# Altium project PE1V2_PCB.PrjPcb
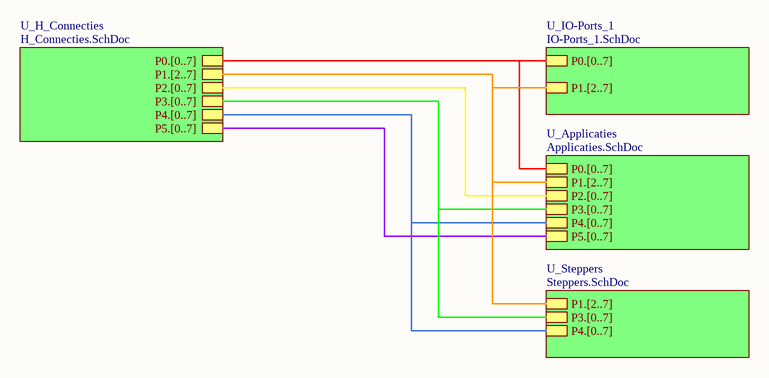
[diagram p0: Top.SchDoc]
5 sheets, 97 parts. Net scope: global (net labels, ports and power ports of the same name join across sheets).
Board file: Pe1V2_PCB.PcbDoc
Sheets:
  Top.SchDoc
    U_H_Connecties = H_Connecties.SchDoc
    U_IO-Ports_1 = IO-Ports_1.SchDoc
    U_Applicaties = Applicaties.SchDoc
    U_Steppers = Steppers.SchDoc

## Sheet Top.SchDoc
size A4; SheetNumber: 1; SheetTotal: 5

### Sub-sheets
U_Applicaties = Applicaties.SchDoc: P5.[0..7], P2.[0..7], P4.[0..7], P3.[0..7], P1.[2..7], P0.[0..7]
U_H_Connecties = H_Connecties.SchDoc: P0.[0..7], P2.[0..7], P4.[0..7], P3.[0..7], P5.[0..7], P1.[2..7]
U_IO-Ports_1 = IO-Ports_1.SchDoc: P0.[0..7], P1.[2..7]
U_Steppers = Steppers.SchDoc: P1.[2..7], P4.[0..7], P3.[0..7]

### Buses and harness runs
bus sheet U_Applicaties/P0.[0..7] = sheet U_H_Connecties/P0.[0..7] = sheet U_IO-Ports_1/P0.[0..7]
bus sheet U_Applicaties/P1.[2..7] = sheet U_H_Connecties/P1.[2..7] = sheet U_IO-Ports_1/P1.[2..7] = sheet U_Steppers/P1.[2..7]
bus sheet U_Applicaties/P2.[0..7] = sheet U_H_Connecties/P2.[0..7]
bus sheet U_Applicaties/P3.[0..7] = sheet U_H_Connecties/P3.[0..7] = sheet U_Steppers/P3.[0..7]
bus sheet U_Applicaties/P4.[0..7] = sheet U_H_Connecties/P4.[0..7] = sheet U_Steppers/P4.[0..7]
bus sheet U_Applicaties/P5.[0..7] = sheet U_H_Connecties/P5.[0..7]

## Sheet H_Connecties.SchDoc
size A4; SheetNumber: 2; SheetTotal: 5
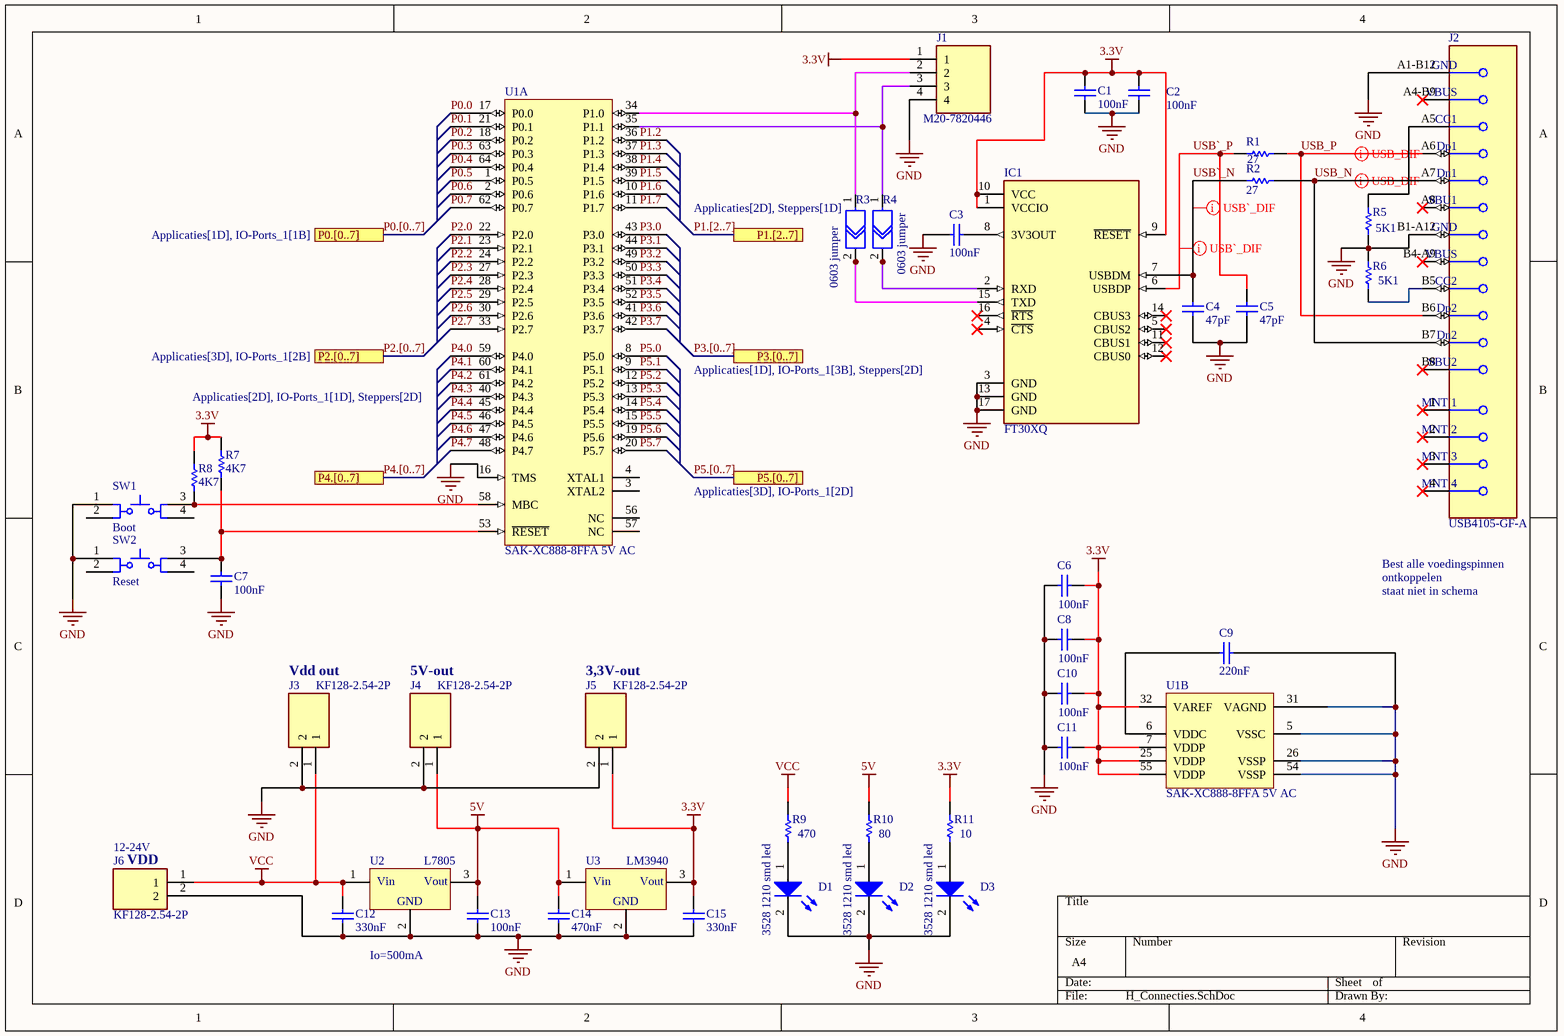
[diagram p1: H_Connecties.SchDoc]

### Parts
C1  100nF  [CAPC1608X90X35LL15T15]
C2  100nF  [CAPC1608X90X35LL15T15]
C3  100nF  [CAPC1608X90X35LL15T15]
C4  47pF  [CAPC1608X90X35LL15T15]
C5  47pF  [CAPC1608X90X35LL15T15]
C6  100nF  [CAPC1608X92X38NL15T08]
C7  100nF  [CAPC1608X90X35LL15T15]
C8  100nF  [CAPC1608X92X38NL15T08]
C9  220nF  [CAPC1608X95X40LL15T15]
C10  100nF  [CAPC1608X92X38NL15T08]
C11  100nF  [CAPC1608X92X38NL15T08]
C12  330nF  [CAPC1608X90X35LL15T15]
C13  100nF  [CAPC1608X90X35LL15T15]
C14  470nF  [CAPC1608X90X35LL15T15]
C15  330nF  [CAPC1608X90X35LL15T15]
D1  3528 1210 smd led  [WL-SITW_3528_L3.5W2.8H1.9]
D2  3528 1210 smd led  [WL-SITW_3528_L3.5W2.8H1.9]
D3  3528 1210 smd led  [WL-SITW_3528_L3.5W2.8H1.9]
IC1  FT30XQ  [FT30XQ]
J1  M20-7820446  [M20-4pin]
J2  USB4105-GF-A  [FP-USB4105-GF-A-MFG]
J3  KF128-2.54-2P  [KF128-2.54-2P]
J4  KF128-2.54-2P  [KF128-2.54-2P]
J5  KF128-2.54-2P  [KF128-2.54-2P]
J6  KF128-2.54-2P  [KF128-2.54-2P]
R1  27  [RESC1608X55X25LL10T15]
R2  27  [RESC1608X55X25LL10T15]
R3  0603 jumper  [0603 jumper]
R4  0603 jumper  [0603 jumper]
R5  5K1  [RESC1608X55X25LL10T15]
R6  5K1  [RESC1608X55X25LL10T15]
R7  4K7  [RESC1608X55X25LL10T15]
R8  4K7  [RESC1608X55X25LL10T15]
R9  470  [RESC1608X55X25LL10T15]
R10  80  [RESC1608X55X25LL10T15]
R11  10  [RESC1608X55X25LL10T15]
SW1  Boot  [ESWI-TL1105SPF_V]
SW2  Reset  [ESWI-TL1105SPF_V]
U1  SAK-XC888-8FFA 5V AC  [INF-PG-TQFP-64-8_L]  (parts A,B of 2)
U2  L7805  [DPAK]
U3  LM3940  [SOT-233]

### Ports
P0.[0..7] (see Applicaties[1D], IO-Ports_1[1B]), P1.[2..7] (see Applicaties[2D], Steppers[1D]), P2.[0..7] (see Applicaties[3D], IO-Ports_1[2B]), P3.[0..7] (see Applicaties[1D], IO-Ports_1[3B], Steppers[2D]), P4.[0..7] (see Applicaties[2D], IO-Ports_1[1D], Steppers[2D]), P5.[0..7] (see Applicaties[3D], IO-Ports_1[2D])

### Nets
3.3V: C1.2 C2.2 C6.2 C8.2 C10.2 C11.2 C15.2 IC1.1(VCCIO) IC1.9(~{RESET}) IC1.10(VCC) J1.1 J5.1 R7.2 R8.2 R11.1 U1.7(VDDP) U1.25(VDDP) U1.32(VAREF) U1.55(VDDP) U3.3
5V: C13.2 C14.2 J4.1 R10.1 U2.3 U3.1
GND: C1.1 C2.1 C3.2 C4.1 C5.1 C6.1 C7.1 C8.1 C9.2 C10.1 C11.1 C12.1 C13.1 C14.1 C15.1 D1.2(K) D2.2(K) D3.2(K) IC1.3(GND) IC1.13(GND) IC1.17(GND) J1.4 J2.A1-B12(GND) J2.B1-A12(GND) J3.2 J4.2 J5.2 J6.2 R5.2 R6.1 SW1.1 SW2.1 U1.5(VSSC) U1.16(TMS) U1.26(VSSP) U1.31(VAGND) U1.54(VSSP) U2.2 U3.2
VCC: C12.2 J3.1 J6.1 R9.1 U2.1
P0.0: U1.17(P0.0)  [project net Led_1]
P0.1: U1.21(P0.1)  [project net Led_2]
P0.2: U1.18(P0.2)  [project net Led_3]
P0.3: U1.63(P0.3)
P0.4: U1.64(P0.4)
P0.5: U1.1(P0.5)
P0.6: U1.2(P0.6)  [project net Led_4]
P0.7: U1.62(P0.7)
P1.2: U1.36(P1.2)  [project net Dir_1_P1.2]
P1.3: U1.37(P1.3)
P1.4: U1.38(P1.4)  [project net Dir_2_P1.4]
P1.5: U1.39(P1.5)
P1.6: U1.10(P1.6)  [project net Led_5]
P1.7: U1.11(P1.7)  [project net Led_6]
P2.0: U1.22(P2.0)
P2.1: U1.23(P2.1)
P2.2: U1.24(P2.2)
P2.3: U1.27(P2.3)
P2.4: U1.28(P2.4)
P2.5: U1.29(P2.5)
P2.6: U1.30(P2.6)
P2.7: U1.33(P2.7)
P3.0: U1.43(P3.0)  [project net P3.0]
P3.1: U1.44(P3.1)  [project net P3.1]
P3.2: U1.49(P3.2)  [project net P3.2]
P3.3: U1.50(P3.3)  [project net P3.3]
P3.4: U1.51(P3.4)  [project net P3.4]
P3.5: U1.52(P3.5)  [project net P3.5]
P3.6: U1.41(P3.6)  [project net P3.6]
P3.7: U1.42(P3.7)  [project net P3.7]
P4.0: U1.59(P4.0)  [project net Enable]
P4.1: U1.60(P4.1)
P4.2: U1.61(P4.2)
P4.3: U1.40(P4.3)
P4.4: U1.45(P4.4)  [project net Dir_5_P4.4]
P4.5: U1.46(P4.5)
P4.6: U1.47(P4.6)  [project net Dir_6_P4.6]
P4.7: U1.48(P4.7)
P5.0: U1.8(P5.0)
P5.1: U1.9(P5.1)
P5.2: U1.12(P5.2)  [project net CS]
P5.3: U1.13(P5.3)  [project net A0]
P5.4: U1.14(P5.4)
P5.5: U1.15(P5.5)
P5.6: U1.19(P5.6)
P5.7: U1.20(P5.7)
USB_N: J2.A7(Dn1) J2.B7(Dn2) R2.1
USB_P: J2.A6(Dp1) J2.B6(Dp2) R1.1
USB`_N: C4.2 IC1.7(USBDM) R2.2
USB`_P: C5.2 IC1.6(USBDP) R1.2
NetC3_1: C3.1 IC1.8(3V3OUT)
NetC7_2: C7.2 R7.1 SW2.3 U1.53(~{RESET})
NetC9_1: C9.1 U1.6(VDDC)
NetD1_1: D1.1(A) R9.2
NetD2_1: D2.1(A) R10.2
NetD3_1: D3.1(A) R11.2
NetIC1_2: IC1.2(RXD) R4.2
NetIC1_15: IC1.15(TXD) R3.2
NetJ1_2: J1.2 R3.1 U1.34(P1.0)
NetJ1_3: J1.3 R4.1 U1.35(P1.1)
NetJ2_A5: J2.A5(CC1) R5.1
NetJ2_B5: J2.B5(CC2) R6.2
NetR8_1: R8.1 SW1.3 U1.58(MBC)

Not connected (* = marked no-connect by the designer): IC1 4(~{CTS})* 5(CBUS2)* 11(CBUS1)* 12(CBUS0)* 14(CBUS3)* 16(~{RTS})*; J2 1(MNT_1)* 2(MNT_2)* 3(MNT_3)* 4(MNT_4)* A4-B9(VBUS)* A8(SBU1)* B4-A9(VBUS)* B8(SBU2)*; SW1 2 4; SW2 2 4; U1 3(XTAL2) 4(XTAL1) 56(NC) 57(NC)

### Buses and harness runs
bus P0.[0..7] = port P0.[0..7]
bus P1.[2..7] = port P1.[2..7]
bus P2.[0..7] = port P2.[0..7]
bus P3.[0..7] = port P3.[0..7]
bus P4.[0..7] = port P4.[0..7]
bus P5.[0..7] = port P5.[0..7]

### Layout directives
differential pair: USB_N, USB_P, USB`_N, USB`_P

### Notes on the sheet
- Best alle voedingspinnen
- ontkoppelen
- staat niet in schema
- Vdd out
- 5V-out
- 3,3V-out
- (near J6) 12-24V
- (near J6) VDD
- Io=500mA
- (in symbol L7805) Vin; Vout; GND
- (in symbol LM3940) Vin; Vout; GND

### Library data of the parts
C1-C5 C7 C12-C15 = CMP-2006-02133-1: Manufacturer: AVX Interconnect / Elco; Part Number: 0603ZC101KAT2A
C6 C8 C10 C11 = CMP-2006-01211-1: Manufacturer: Vitramon; Part Number: VJ0603Y104KXJAP
C9 = CMP-2006-00068-1: Part Number: VJ0603Y224KXXCW1BC; Manufacturer: Vitramon
D1-D3 = CMP-03913-90235592-1: 15414185BA210 WL-SITW SMT InfraRed TopLED Waterclear; Forward Current: 700mA; Wavelength: 850nm; Max Reverse Voltage (DC): 5V; Forward Voltage: 1.5V; Viewing Angle: 120°; Length: 3.2mm; NexarPartId: 90235592; Width: 2.8mm; RoHS: Compliant; Packaging: Tape and Reel; Max Operating Temperature: 85°C; Peak Wavelength: 850nm; Min Operating Temperature: -40°C; Height: 1.9mm
J1 = M20-7820446: Connector; Manufacturer_Name: Harwin; Datasheet Link: https://cdn.harwin.com/pdfs/M20-782.pdf; Height: 8.65mm; Manufacturer_Part_Number: M20-7820446; Mouser Part Number: 855-M20-7820446; Mouser Price/Stock: https://www.mouser.co.uk/ProductDetail/Harwin/M20-7820446?qs=vF78I%252BjhbY8%252Bno0H8mp9XA%3D%3D
J2 = CMP-245163-000001-1: CONN RCPT USB2.0 TYPEC 5A; Manufacturer: GCT; Voltage Rating: 20V; Is Female: yes; Current Rating: 5/6.25/1.25/0.25A; Number Of Contacts: 16; Conn Orientation: Right Angle; Device Class L1: Connectors; Category: Conn; Lead Free: Yes; RoHS: TRUE; Temperature Range High: +85°C; Digikey Description: CONN RCPT USB2.0 TYPEC 5A; Device Class L3: unset; ComponentLink2Description: Datasheet; Manufacturer Part Number: USB4105-GF-A; Package: 0; Usb Standard: USB 2.0; Device Class L2: USB Connectors; Automotive: No; Temperature Range Low: -40°C; Height: 3.46mm; Temperature: -40°C to +85°C; Contact Material: Gold,Nickel; ComponentLink2URL: https://gct.co/files/drawings/usb4105.pdf; Octopart: https://octopart.com/usb4105-gf-a-gct-106627878
J3-J6 = KF128-2.54-2P: Connector; Manufacturer_Name: CIXI KEFA ELECTRONICS; Datasheet Link: https://jirorwxhqiillo5p.ldycdn.com/KF128-2.54-aidqpBpqKirRliSqmrqirlki.pdf; Height: 9.1mm; Manufacturer_Part_Number: KF128-2.54-2P
R1 R2 R5-R11 = CMP-2000-04183-1: Part Number: RC0603FR-102KL; Manufacturer: Yageo
SW1 SW2 = CMP-2000-07248-1: Tact Switch, SPST-NO, 50 mA, 12 VDC, -20 to 70 degC, 4-Pin THD, RoHS, Bulk; Manufacturer: E-Switch; Actuation Force: 1.6N; Actuator Style: RoundButton; Package URL: http://spec_sheets.e-switch.com/specs/P010201.pdf; Contact Material: Silver; Size: 6x6mm; Manufacturer URL: http://www.e-switch.ch/en/; Datasheet Version: 12/2013; Package Description: 4-Pin Through Hole Device, Body 6 x 6 mm; Datasheet URL: https://www.e-switch.com/system/asset/product_line/data_sheet/140/TL1105.pdf; Termination Style: RightAngle; Package Reference: TL1105SPF; Mounting Technology: ThroughHole
U1 = CMP-1147-00075-1: 24 MHz XC800-Automotive MCU with 32 KByte Program Memory, 1.75 KByte SRAM, 5 V, PG-LQFP-64, Reel, Green; Manufacturer: Infineon; A / D input lines (incl. FADC): 8; Digital I/O Lines: 48; Oscillator Watchdog: TRUE; Serial I/O Interfaces: 3; Real Time Clock (RTC): FALSE; I/O Operation Voltages: 5Â V; Program Memory: 32Â KByte; SRAM (incl. Cache): 1.75Â KByte; Max Clock Frequency: 24Â MHz; Type of Memory: Flash; Timer / Counter: 4; CAN Nodes: 0; Type of Serial I/O Interfaces: UART(2), SSC(1); Number of ADC Modules: 1; LIN BSL loader (for fast Flash programming): FALSE; ComponentLink2Description: Datasheet; ComponentLink2URL: http://www.infineon.com/dgdl/XC88xCLM_ds_V1_2.pdf?folderId=db3a304412b407950112b408e8c90004&fileId=db3a304412b407950112b40c4a9e0afb; ComponentLink3URL: http://www.infineon.com/dgdl/xc164lm_ds_v1.2_2007_03.pdf?folderId=db3a304412b407950112b408e8c90004&fileId=db3a304412b407950112b40c22200a81&sId=db3a30433d956bc3013d9e7060dd2801; PartNumber: SAK-XC888-8FFA 5V AC; PackageReference: PG-TQFP-64-8; PackageDescription: 64-Pin Plastic Thin Quad Flat Package, Body 10 x 10 mm, Pitch 0.5 mm; DSP functionality (e.g MDU/MAC): FALSE; On-chip Voltage Regulator: TRUE; On-chip clock generation: TRUE; Mounting Technology: Surface Mount; Green: TRUE; Watchdog Timer: TRUE; Instruction width [bits]: 8; DatasheetVersion: Rev. 1.2; Halogen-free: TRUE; ComponentLink1Description: Manufacturer URL; PackageVersion: V1.2, 03/2007; ComponentLink1URL: http://www.infineon.com/; Timed I/O Pins (PWM-Ch,CAPCOM): 4; Power Modes: 4; DMA Channels: 0; ComponentLink3Description: Package Specification; E2PROM Emulation (Data-Flash): TRUE
U2 = L7805: Linaire spannings omvormer
U3 = LM3940: 5V --> 3.3V

## Sheet IO-Ports_1.SchDoc
size A4; SheetNumber: 5; SheetTotal: 5
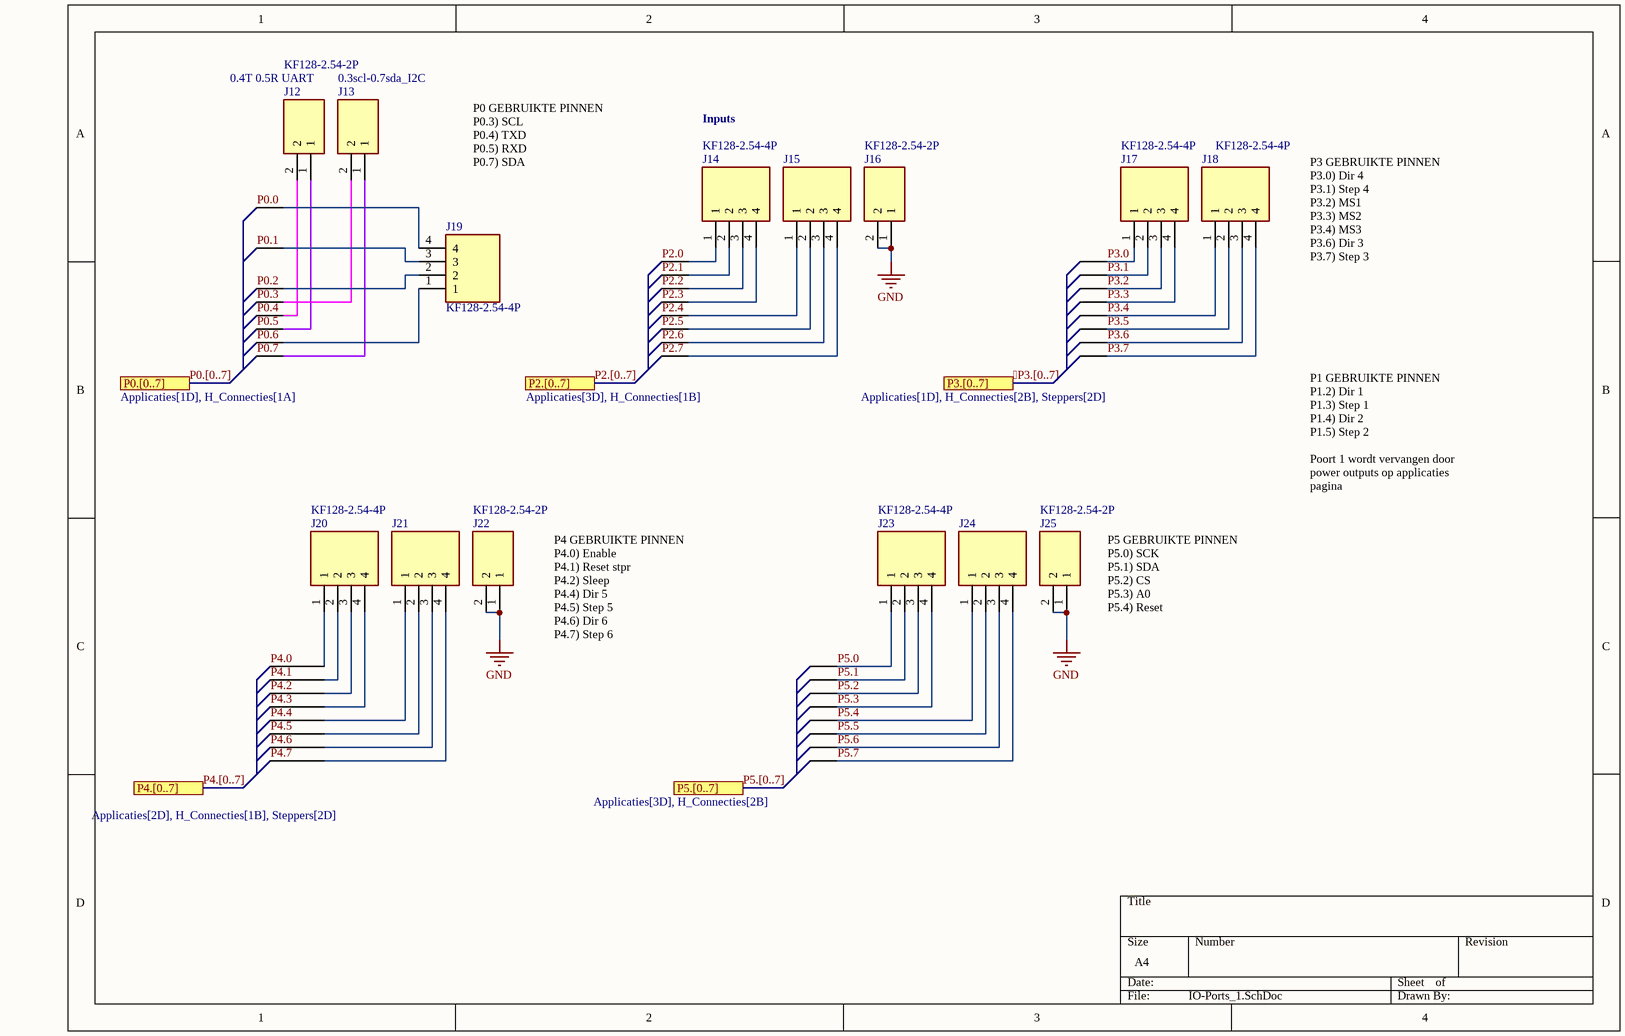
[diagram p2: IO-Ports_1.SchDoc]

### Parts
J12  KF128-2.54-2P  [KF128-2.54-2P]
J13  (no value)  [KF128-2.54-2P]
J14  KF128-2.54-4P  [KF128-2.54-4P]
J15  (no value)  [KF128-2.54-4P]
J16  KF128-2.54-2P  [KF128-2.54-2P]
J17  KF128-2.54-4P  [KF128-2.54-4P]
J18  KF128-2.54-4P  [KF128-2.54-4P]
J19  KF128-2.54-4P  [KF128-2.54-4P]
J20  KF128-2.54-4P  [KF128-2.54-4P]
J21  (no value)  [KF128-2.54-4P]
J22  KF128-2.54-2P  [KF128-2.54-2P]
J23  KF128-2.54-4P  [KF128-2.54-4P]
J24  (no value)  [KF128-2.54-4P]
J25  KF128-2.54-2P  [KF128-2.54-2P]

### Ports
P0.[0..7] (see Applicaties[1D], H_Connecties[1A]), P2.[0..7] (see Applicaties[3D], H_Connecties[1B]), P3.[0..7] (see Applicaties[1D], H_Connecties[2B], Steppers[2D]), P4.[0..7] (see Applicaties[2D], H_Connecties[1B], Steppers[2D]), P5.[0..7] (see Applicaties[3D], H_Connecties[2B])

### Nets
GND: J16.1 J16.2 J22.1 J22.2 J25.1 J25.2
P0.0: J19.4  [project net Led_1]
P0.1: J19.3  [project net Led_2]
P0.2: J19.2  [project net Led_3]
P0.3: J13.2
P0.4: J12.2
P0.5: J12.1
P0.6: J19.1  [project net Led_4]
P0.7: J13.1
P2.0: J14.1
P2.1: J14.2
P2.2: J14.3
P2.3: J14.4
P2.4: J15.1
P2.5: J15.2
P2.6: J15.3
P2.7: J15.4
P3.0: J17.1  [project net P3.0]
P3.1: J17.2  [project net P3.1]
P3.2: J17.3  [project net P3.2]
P3.3: J17.4  [project net P3.3]
P3.4: J18.1  [project net P3.4]
P3.5: J18.2  [project net P3.5]
P3.6: J18.3  [project net P3.6]
P3.7: J18.4  [project net P3.7]
P4.0: J20.1  [project net Enable]
P4.1: J20.2
P4.2: J20.3
P4.3: J20.4
P4.4: J21.1  [project net Dir_5_P4.4]
P4.5: J21.2
P4.6: J21.3  [project net Dir_6_P4.6]
P4.7: J21.4
P5.0: J23.1
P5.1: J23.2
P5.2: J23.3  [project net CS]
P5.3: J23.4  [project net A0]
P5.4: J24.1
P5.5: J24.2
P5.6: J24.3
P5.7: J24.4

### Buses and harness runs
bus P3.[0..7] =  = port P3.[0..7]
bus P0.[0..7] = port P0.[0..7]
bus P2.[0..7] = port P2.[0..7]
bus P4.[0..7] = port P4.[0..7]
bus P5.[0..7] =  = port P5.[0..7]

### Notes on the sheet
- 0.4T 0.5R UART
- 0.3scl-0.7sda_I2C
- P0 GEBRUIKTE PINNEN
  P0.3) SCL
  P0.4) TXD
  P0.5) RXD
  P0.7) SDA
- Inputs
- P3 GEBRUIKTE PINNEN
  P3.0) Dir 4
  P3.1) Step 4
  P3.2) MS1
  P3.3) MS2
  P3.4) MS3
  P3.6) Dir 3
  P3.7) Step 3
- P1 GEBRUIKTE PINNEN
  P1.2) Dir 1
  P1.3) Step 1
  P1.4) Dir 2
  P1.5) Step 2
  Poort 1 wordt vervangen door power outputs op applicaties pagina
- P4 GEBRUIKTE PINNEN
  P4.0) Enable
  P4.1) Reset stpr
  P4.2) Sleep
  P4.4) Dir 5
  P4.5) Step 5
  P4.6) Dir 6
  P4.7) Step 6
- (near J25) P5 GEBRUIKTE PINNEN
  P5.0) SCK
  P5.1) SDA
  P5.2) CS
  P5.3) A0
  P5.4) Reset

### Library data of the parts
J12 J13 J16 J22 J25 = KF128-2.54-2P: as J3 on sheet H_Connecties; Datasheet Link: https://jirorwxhqiillo5p.ldycdn.com/KF128-2.54-aidqpBpqKirRliSqmrqirlki.pdf; Height: 9.1mm; Manufacturer_Part_Number: KF128-2.54-2P
  J12: Parameter 1: *
J14 J15 J17-J21 J23 J24 = KF128-2.54-4P: Connector; Manufacturer_Name: CIXI KEFA ELECTRONICS; Datasheet Link: https://jirorwxhqiillo5p.ldycdn.com/KF128-2.54-aidqpBpqKirRliSqmrqirlki.pdf; Height: 9.1mm; Manufacturer_Part_Number: KF128-2.54-4P

## Sheet Applicaties.SchDoc
size A4; SheetNumber: 3; SheetTotal: 5
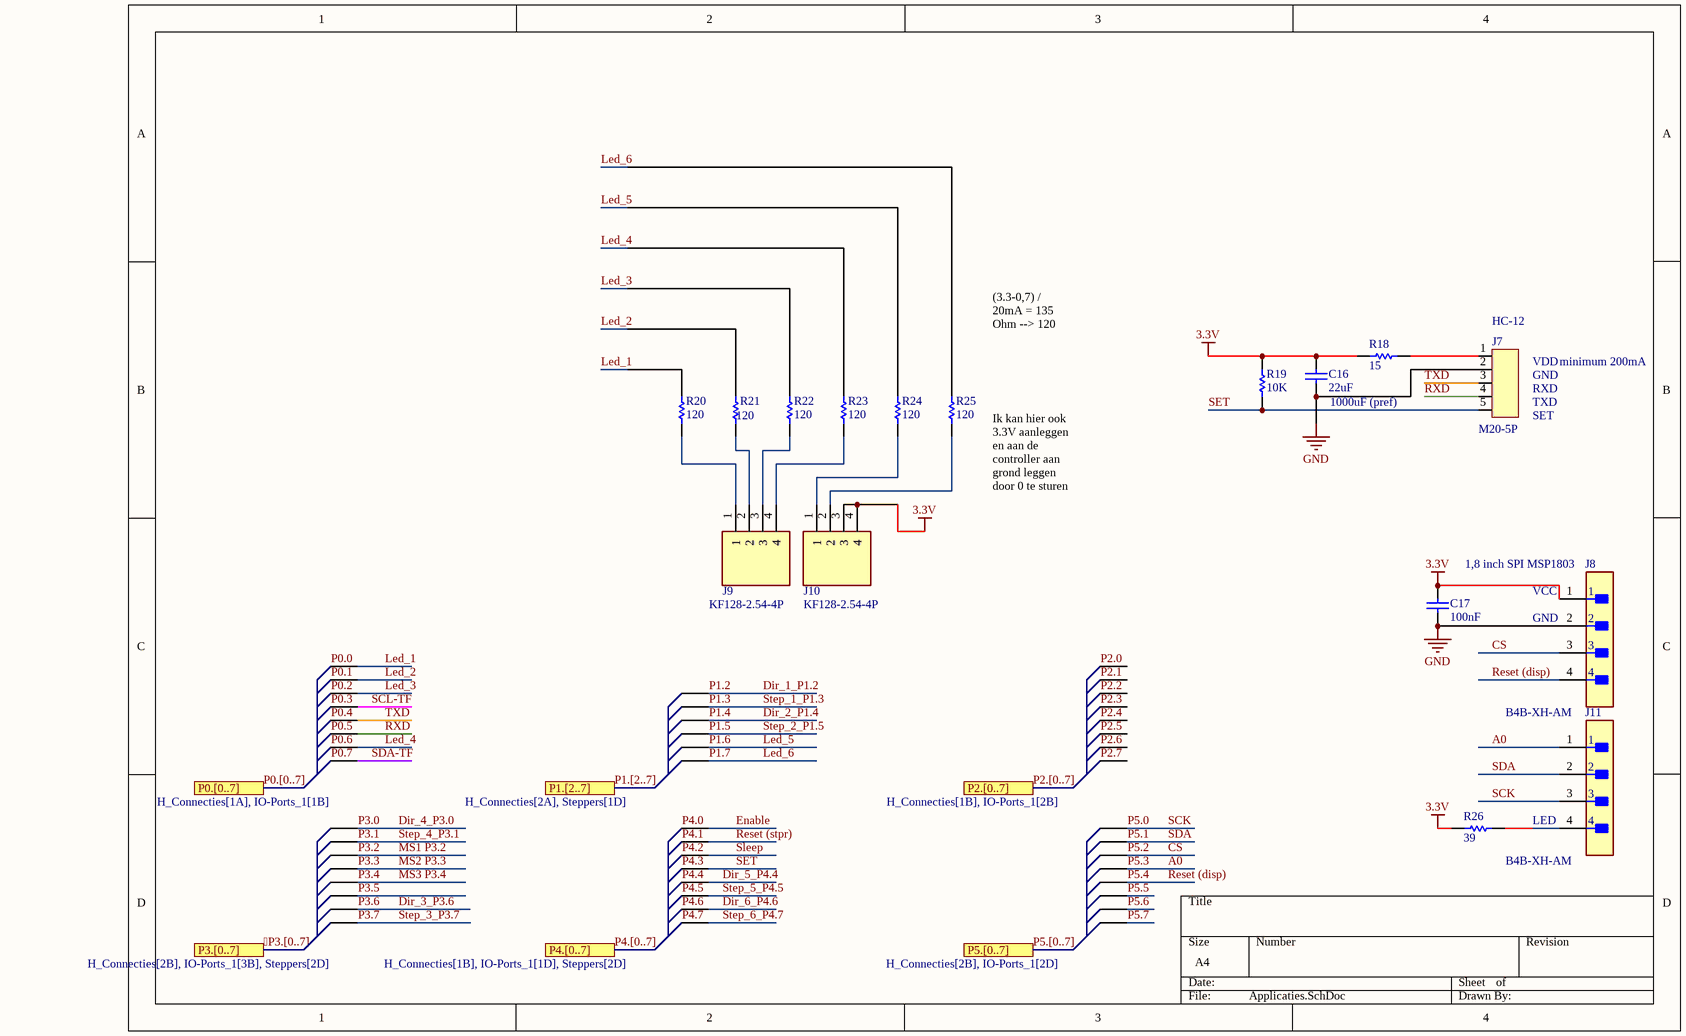
[diagram p3: Applicaties.SchDoc]

### Parts
C16  22uF  [CAPC1608X90X35LL15T15]
C17  100nF  [CAPC1608X90X35LL15T15]
J7  M20-5P  [M20-5PIN]
J8  B4B-XH-AM  [FP-B4B-XH-A_LF_SN-MFG]
J9  KF128-2.54-4P  [KF128-2.54-4P]
J10  KF128-2.54-4P  [KF128-2.54-4P]
J11  B4B-XH-AM  [FP-B4B-XH-A_LF_SN-MFG]
R18  15  [RESC1608X55X25LL10T15]
R19  10K  [RESC1608X55X25LL10T15]
R20  120  [RESC1608X55X25LL10T15]
R21  120  [RESC1608X55X25LL10T15]
R22  120  [RESC1608X55X25LL10T15]
R23  120  [RESC1608X55X25LL10T15]
R24  120  [RESC1608X55X25LL10T15]
R25  120  [RESC1608X55X25LL10T15]
R26  39  [RESC1608X55X25LL10T15]

### Ports
P0.[0..7] (see H_Connecties[1A], IO-Ports_1[1B]), P1.[2..7] (see H_Connecties[2A], Steppers[1D]), P2.[0..7] (see H_Connecties[1B], IO-Ports_1[2B]), P3.[0..7] (see H_Connecties[2B], IO-Ports_1[3B], Steppers[2D]), P4.[0..7] (see H_Connecties[1B], IO-Ports_1[1D], Steppers[2D]), P5.[0..7] (see H_Connecties[2B], IO-Ports_1[2D])

### Nets
3.3V: C16.2 C17.2 J8.1 J10.3 J10.4 R18.2 R19.1 R26.1
GND: C16.1 C17.1 J7.2 J8.2
A0: J11.1  [also labelled P5.3]
CS: J8.3  [also labelled P5.2]
Led_1: R20.1  [also labelled P0.0]
Led_2: R21.1  [also labelled P0.1]
Led_3: R22.1  [also labelled P0.2]
Led_4: R23.1  [also labelled P0.6]
Led_5: R24.1  [also labelled P1.6]
Led_6: R25.1  [also labelled P1.7]
P0.4: J7.3  [also labelled TXD]
P0.5: J7.4  [also labelled RXD]
P4.3: J7.5 R19.2  [also labelled SET]
P5.0: J11.3  [also labelled SCK]
P5.1: J11.2  [also labelled SDA]
P5.4: J8.4  [also labelled Reset (disp)]
NetJ7_1: J7.1 R18.1
NetJ9_1: J9.1 R20.2
NetJ9_2: J9.2 R21.2
NetJ9_3: J9.3 R22.2
NetJ9_4: J9.4 R23.2
NetJ10_1: J10.1 R24.2
NetJ10_2: J10.2 R25.2
NetJ11_4: J11.4 R26.2

### Buses and harness runs
bus P3.[0..7] =  = port P3.[0..7]
bus P0.[0..7] = port P0.[0..7]
bus P1.[2..7] =  = port P1.[2..7]
bus P2.[0..7] = port P2.[0..7]
bus P4.[0..7] = port P4.[0..7]
bus P5.[0..7] =  = port P5.[0..7]

### Notes on the sheet
- (near R25) (3.3-0,7) / 20mA = 135 Ohm --> 120
- (near J7) HC-12
- (near J7) VDD
- (near J7) GND
- minimum 200mA
- (near C16) 1000uF (pref)
- (near J7) RXD
- (near J7) TXD
- (near J7) SET
- (near R25) Ik kan hier ook 3.3V aanleggen en aan de controller aan grond leggen door 0 te sturen (naar grond trekken)
  dan moet de controller geen stroom leveren
- 1,8 inch SPI MSP1803
- (near J8) VCC
- (near J8) GND
- LED

### Library data of the parts
C16 C17 = CMP-2006-02133-1: as C1 on sheet H_Connecties
J8 J11 = CMP-17439-000250-1: CONN HEADER VERT 4POS 2.5MM; Number of Contacts: 4; Contact Resistance: 20mR; Voltage Rating: 250V; Max Current Rating: 3A; Gender: Male; Wire/Cable Gauge: 22AWG; Mated Stacking Heights: 9.8mm; Insulation Resistance: 1GR; Orientation: Straight; Contact Type: Male Pin; Contact Finish - Mating: TIN; Series: XH; Max Voltage Rating (AC): 250V; Lead Pitch: 2.5mm; Contact Shape: Square; Insulation Color: Natural; Termination: Solder; Lead Free: Lead Free; Voltage Rating (AC): 250V; Number of Rows: 1; Flammability Rating: UL94 V-0; Number of Positions: 4; Max Operating Temperature: 85°C; Package Quantity: 500; Mount: Through Hole; REACH SVHC: No SVHC; Connector Type: Header; Insulation Material: Nylon; Fastening Type: Detent; Min Operating Temperature: -25°C; Housing Color: White; Packaging: Bulk; Contact Plating: Tin; Contact Material: Brass; Max Voltage Rating (DC): 250V; Housing Material: Polyamide; Color: Natural; Material: Polyamide; Pitch: 2.5mm; Depth: 5.75mm; Current Rating: 3A; Length: 12.4mm
J9 J10 = KF128-2.54-4P: as J14 on sheet IO-Ports_1; Datasheet Link: https://jirorwxhqiillo5p.ldycdn.com/KF128-2.54-aidqpBpqKirRliSqmrqirlki.pdf; Height: 9.1mm; Manufacturer_Part_Number: KF128-2.54-4P
R18-R26 = CMP-2000-04183-1: as R1 on sheet H_Connecties

## Sheet Steppers.SchDoc
size A4; SheetNumber: 4; SheetTotal: 5
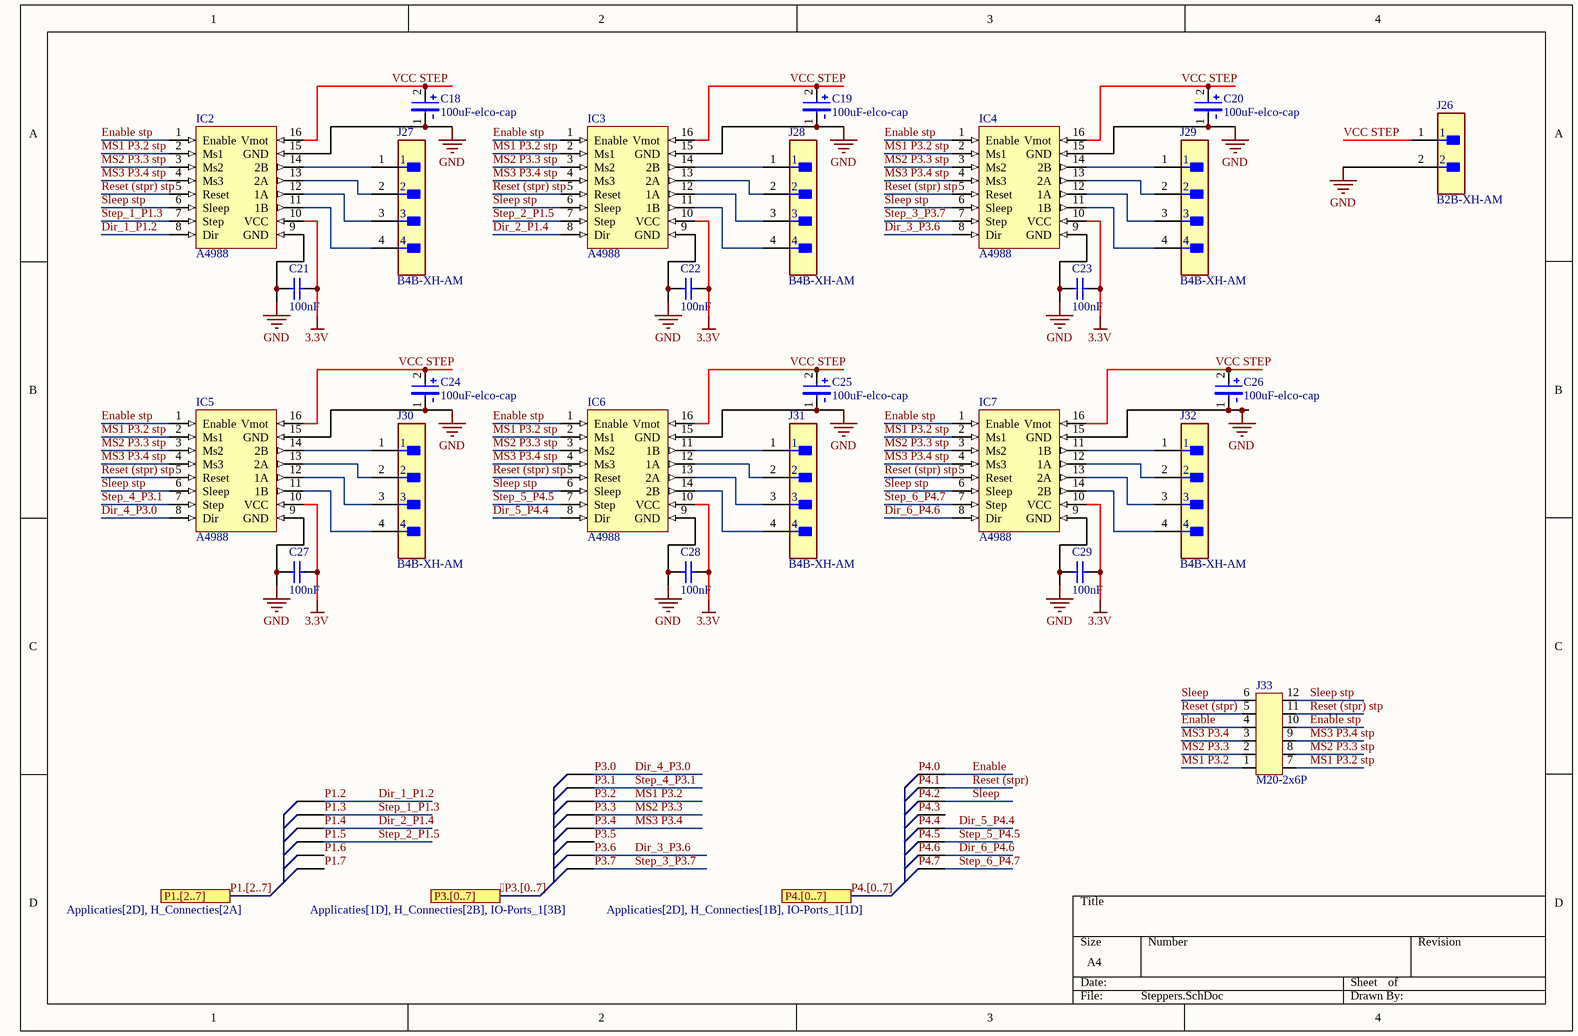
[diagram p4: Steppers.SchDoc]

### Parts
C18  100uF-elco-cap  [SMD-ELCO-CAP]
C19  100uF-elco-cap  [SMD-ELCO-CAP]
C20  100uF-elco-cap  [SMD-ELCO-CAP]
C21  100nF  [CAPC1608X90X35LL15T15]
C22  100nF  [CAPC1608X90X35LL15T15]
C23  100nF  [CAPC1608X90X35LL15T15]
C24  100uF-elco-cap  [SMD-ELCO-CAP]
C25  100uF-elco-cap  [SMD-ELCO-CAP]
C26  100uF-elco-cap  [SMD-ELCO-CAP]
C27  100nF  [CAPC1608X90X35LL15T15]
C28  100nF  [CAPC1608X90X35LL15T15]
C29  100nF  [CAPC1608X90X35LL15T15]
IC2  A4988  [A4988]
IC3  A4988  [A4988]
IC4  A4988  [A4988]
IC5  A4988  [A4988]
IC6  A4988  [A4988]
IC7  A4988  [A4988]
J26  B2B-XH-AM  [FP-B2B-XH-AM_LF_SN-MFG]
J27  B4B-XH-AM  [FP-B4B-XH-A_LF_SN-MFG]
J28  B4B-XH-AM  [FP-B4B-XH-A_LF_SN-MFG]
J29  B4B-XH-AM  [FP-B4B-XH-A_LF_SN-MFG]
J30  B4B-XH-AM  [FP-B4B-XH-A_LF_SN-MFG]
J31  B4B-XH-AM  [FP-B4B-XH-A_LF_SN-MFG]
J32  B4B-XH-AM  [FP-B4B-XH-A_LF_SN-MFG]
J33  M20-2x6P  [M20-2x6PIN]

### Ports
P1.[2..7] (see Applicaties[2D], H_Connecties[2A]), P3.[0..7] (see Applicaties[1D], H_Connecties[2B], IO-Ports_1[3B]), P4.[0..7] (see Applicaties[2D], H_Connecties[1B], IO-Ports_1[1D])

### Nets
3.3V: C21.1 C22.1 C23.1 C27.1 C28.1 C29.1 IC2.10(VCC) IC3.10(VCC) IC4.10(VCC) IC5.10(VCC) IC6.10(VCC) IC7.10(VCC)
GND: C18.1 C19.1 C20.1 C21.2 C22.2 C23.2 C24.1 C25.1 C26.1 C27.2 C28.2 C29.2 IC2.9(GND) IC2.15(GND) IC3.9(GND) IC3.15(GND) IC4.9(GND) IC4.15(GND) IC5.9(GND) IC5.15(GND) IC6.9(GND) IC6.15(GND) IC7.9(GND) IC7.15(GND) J26.2
Dir_1_P1.2: IC2.8(Dir)  [also labelled P1.2]
Dir_2_P1.4: IC3.8(Dir)  [also labelled P1.4]
Dir_3_P3.6: IC4.8(Dir)  [also labelled P3.6]  [project net P3.6]
Dir_4_P3.0: IC5.8(Dir)  [also labelled P3.0]  [project net P3.0]
Dir_5_P4.4: IC6.8(Dir)  [also labelled P4.4]
Dir_6_P4.6: IC7.8(Dir)  [also labelled P4.6]
Enable: J33.4  [also labelled P4.0]
Enable stp: IC2.1(Enable) IC3.1(Enable) IC4.1(Enable) IC5.1(Enable) IC6.1(Enable) IC7.1(Enable) J33.10
MS1 P3.2: J33.1  [also labelled P3.2]  [project net P3.2]
MS1 P3.2 stp: IC2.2(Ms1) IC3.2(Ms1) IC4.2(Ms1) IC5.2(Ms1) IC6.2(Ms1) IC7.2(Ms1) J33.7
MS2 P3.3: J33.2  [also labelled P3.3]  [project net P3.3]
MS2 P3.3 stp: IC2.3(Ms2) IC3.3(Ms2) IC4.3(Ms2) IC5.3(Ms2) IC6.3(Ms2) IC7.3(Ms2) J33.8
MS3 P3.4: J33.3  [also labelled P3.4]  [project net P3.4]
MS3 P3.4 stp: IC2.4(Ms3) IC3.4(Ms3) IC4.4(Ms3) IC5.4(Ms3) IC6.4(Ms3) IC7.4(Ms3) J33.9
P1.3: IC2.7(Step)  [also labelled Step_1_P1.3]
P1.5: IC3.7(Step)  [also labelled Step_2_P1.5]
P3.1: IC5.7(Step)  [also labelled Step_~{4}_P3.1]  [project net P3.1]
P3.7: IC4.7(Step)  [also labelled Step_3_P3.7]  [project net P3.7]
P4.1: J33.5  [also labelled Reset (stpr)]
P4.2: J33.6  [also labelled Sleep]
P4.5: IC6.7(Step)  [also labelled Step_5_P4.5]
P4.7: IC7.7(Step)  [also labelled Step_6_P4.7]
Reset (stpr) stp: IC2.5(Reset) IC3.5(Reset) IC4.5(Reset) IC5.5(Reset) IC6.5(Reset) IC7.5(Reset) J33.11
Sleep stp: IC2.6(Sleep) IC3.6(Sleep) IC4.6(Sleep) IC5.6(Sleep) IC6.6(Sleep) IC7.6(Sleep) J33.12
VCC STEP: C18.2 C19.2 C20.2 C24.2 C25.2 C26.2 IC2.16(Vmot) IC3.16(Vmot) IC4.16(Vmot) IC5.16(Vmot) IC6.16(Vmot) IC7.16(Vmot) J26.1
NetIC2_11: IC2.11(1B) J27.4
NetIC2_12: IC2.12(1A) J27.3
NetIC2_13: IC2.13(2A) J27.2
NetIC2_14: IC2.14(2B) J27.1
NetIC3_11: IC3.11(1B) J28.4
NetIC3_12: IC3.12(1A) J28.3
NetIC3_13: IC3.13(2A) J28.2
NetIC3_14: IC3.14(2B) J28.1
NetIC4_11: IC4.11(1B) J29.4
NetIC4_12: IC4.12(1A) J29.3
NetIC4_13: IC4.13(2A) J29.2
NetIC4_14: IC4.14(2B) J29.1
NetIC5_11: IC5.11(1B) J30.4
NetIC5_12: IC5.12(1A) J30.3
NetIC5_13: IC5.13(2A) J30.2
NetIC5_14: IC5.14(2B) J30.1
NetIC6_11: IC6.11(1B) J31.1
NetIC6_12: IC6.12(1A) J31.2
NetIC6_13: IC6.13(2A) J31.3
NetIC6_14: IC6.14(2B) J31.4
NetIC7_11: IC7.11(1B) J32.1
NetIC7_12: IC7.12(1A) J32.2
NetIC7_13: IC7.13(2A) J32.3
NetIC7_14: IC7.14(2B) J32.4

### Buses and harness runs
bus P3.[0..7] =  = port P3.[0..7]
bus P1.[2..7] =  = port P1.[2..7]
bus P4.[0..7] = port P4.[0..7]

### Library data of the parts
C18-C20 C24-C26 = 100uF-elco-cap: Max 35V
C21-C23 C27-C29 = CMP-2006-02133-1: as C1 on sheet H_Connecties
IC2-IC7 = A4988: stappenmotor driver
J26 = CMP-17439-000037-1: CONN HEADER VERT 2POS 2.5MM; Max Voltage Rating (AC): 250V; Connector Type: Male Pin; Contact Resistance: 20mR; Max Current Rating: 3A; Number of Positions: 2; Series: XH; Contact Material: Brass; Mount: Through Hole; Housing Material: Polyamide; Contact Plating: Tin; Termination: Solder; Max Operating Temperature: 85°C; Depth: 5.75mm; Packaging: Bulk; Min Operating Temperature: -25°C; Contact Type: Male Pin; Color: Green; Pitch: 2.5mm; Length: 7.4mm; Lead Free: Lead Free; Number of Rows: 1; Fastening Type: Detent; Housing Color: White; Orientation: Straight
J27-J32 = CMP-17439-000250-1: as J8 on sheet Applicaties; Orientation: Straight; Contact Type: Male Pin; Contact Finish - Mating: TIN; Series: XH; Max Voltage Rating (AC): 250V; Lead Pitch: 2.5mm; Contact Shape: Square; Insulation Color: Natural; Termination: Solder; Lead Free: Lead Free; Voltage Rating (AC): 250V; Number of Rows: 1; Flammability Rating: UL94 V-0; Number of Positions: 4; Max Operating Temperature: 85°C; Package Quantity: 500; Mount: Through Hole; REACH SVHC: No SVHC; Connector Type: Header; Insulation Material: Nylon; Fastening Type: Detent; Min Operating Temperature: -25°C; Housing Color: White; Packaging: Bulk; Contact Plating: Tin; Contact Material: Brass; Max Voltage Rating (DC): 250V; Housing Material: Polyamide; Color: Natural; Material: Polyamide; Pitch: 2.5mm; Depth: 5.75mm; Current Rating: 3A; Length: 12.4mm

## Nets that join several sheets
3.3V: H_Connecties (20 pins), Applicaties (8 pins), Steppers (12 pins)
GND: H_Connecties (39 pins), IO-Ports_1 (6 pins), Applicaties (C16.1 C17.1 J7.2 J8.2), Steppers (25 pins)
P3.0: H_Connecties (U1.43), IO-Ports_1 (J17.1), Steppers (IC5.8)
P3.1: H_Connecties (U1.44), IO-Ports_1 (J17.2), Steppers (IC5.7)
P3.2: H_Connecties (U1.49), IO-Ports_1 (J17.3), Steppers (J33.1)
P3.3: H_Connecties (U1.50), IO-Ports_1 (J17.4), Steppers (J33.2)
P3.4: H_Connecties (U1.51), IO-Ports_1 (J18.1), Steppers (J33.3)
P3.5: H_Connecties (U1.52), IO-Ports_1 (J18.2)
P3.6: H_Connecties (U1.41), IO-Ports_1 (J18.3), Steppers (IC4.8)
P3.7: H_Connecties (U1.42), IO-Ports_1 (J18.4), Steppers (IC4.7)
A0: H_Connecties (U1.13), IO-Ports_1 (J23.4), Applicaties (J11.1)
CS: H_Connecties (U1.12), IO-Ports_1 (J23.3), Applicaties (J8.3)
Dir_1_P1.2: H_Connecties (U1.36), Steppers (IC2.8)
Dir_2_P1.4: H_Connecties (U1.38), Steppers (IC3.8)
Dir_5_P4.4: H_Connecties (U1.45), IO-Ports_1 (J21.1), Steppers (IC6.8)
Dir_6_P4.6: H_Connecties (U1.47), IO-Ports_1 (J21.3), Steppers (IC7.8)
Enable: H_Connecties (U1.59), IO-Ports_1 (J20.1), Steppers (J33.4)
Led_1: H_Connecties (U1.17), IO-Ports_1 (J19.4), Applicaties (R20.1)
Led_2: H_Connecties (U1.21), IO-Ports_1 (J19.3), Applicaties (R21.1)
Led_3: H_Connecties (U1.18), IO-Ports_1 (J19.2), Applicaties (R22.1)
Led_4: H_Connecties (U1.2), IO-Ports_1 (J19.1), Applicaties (R23.1)
Led_5: H_Connecties (U1.10), Applicaties (R24.1)
Led_6: H_Connecties (U1.11), Applicaties (R25.1)
P0.3: H_Connecties (U1.63), IO-Ports_1 (J13.2)
P0.4: H_Connecties (U1.64), IO-Ports_1 (J12.2), Applicaties (J7.3)
P0.5: H_Connecties (U1.1), IO-Ports_1 (J12.1), Applicaties (J7.4)
P0.7: H_Connecties (U1.62), IO-Ports_1 (J13.1)
P1.3: H_Connecties (U1.37), Steppers (IC2.7)
P1.5: H_Connecties (U1.39), Steppers (IC3.7)
P2.0: H_Connecties (U1.22), IO-Ports_1 (J14.1)
P2.1: H_Connecties (U1.23), IO-Ports_1 (J14.2)
P2.2: H_Connecties (U1.24), IO-Ports_1 (J14.3)
P2.3: H_Connecties (U1.27), IO-Ports_1 (J14.4)
P2.4: H_Connecties (U1.28), IO-Ports_1 (J15.1)
P2.5: H_Connecties (U1.29), IO-Ports_1 (J15.2)
P2.6: H_Connecties (U1.30), IO-Ports_1 (J15.3)
P2.7: H_Connecties (U1.33), IO-Ports_1 (J15.4)
P4.1: H_Connecties (U1.60), IO-Ports_1 (J20.2), Steppers (J33.5)
P4.2: H_Connecties (U1.61), IO-Ports_1 (J20.3), Steppers (J33.6)
P4.3: H_Connecties (U1.40), IO-Ports_1 (J20.4), Applicaties (J7.5 R19.2)
P4.5: H_Connecties (U1.46), IO-Ports_1 (J21.2), Steppers (IC6.7)
P4.7: H_Connecties (U1.48), IO-Ports_1 (J21.4), Steppers (IC7.7)
P5.0: H_Connecties (U1.8), IO-Ports_1 (J23.1), Applicaties (J11.3)
P5.1: H_Connecties (U1.9), IO-Ports_1 (J23.2), Applicaties (J11.2)
P5.4: H_Connecties (U1.14), IO-Ports_1 (J24.1), Applicaties (J8.4)
P5.5: H_Connecties (U1.15), IO-Ports_1 (J24.2)
P5.6: H_Connecties (U1.19), IO-Ports_1 (J24.3)
P5.7: H_Connecties (U1.20), IO-Ports_1 (J24.4)